# Altium schematic sheet Sheet3.SchDoc
size A; SheetNumber: 1; SheetTotal: 1; SPICEModelCacheSPCDLQCX: <root> / <DocumentId>SPCDLQCX</DocumentId> / <CacheFrame Number="0"> / <Model Name="nmos" Kind="MDL"> / <Text>*Default N-Channel MOSFET / *Pinout: D,G,S / .MODEL NMOS NMOS()</Text> / </Model> / <Model Name="led3" Kind="MDL"> / <Text>*Typ BLUE SiC LED: Vf=3.4V Vr=5V If=40mA trr=3uS / *LED Pinout: 1=A, 2=K / .MODEL LED3 D (IS=93.1P RS=42M N=7.47 BV=5 IBV=30U / + CJO=2.97P VJ=.75 M=.333 TT=4.32U)</Text> / </Model> / <Model Name="led2" Kind="MDL"> / <Text>*Typ RED,GREEN,YELLOW,AMBER GaAs LED: Vf=2.1V Vr=4V If=40mA trr=3uS / *LED Pinout: 1=A, 2=K / .MODEL LED2 D (IS=93.1P RS=42M N=4.61 BV=4 IBV=10U / + CJO=2.97P VJ=.75 M=.333 TT=4.32U)</Text> / </Model> / <Model Name="led1" Kind="MDL"> / <Text>*Typ RED GaAs LED: Vf=1.7V Vr=4V If=40mA trr=3uS / *LED Pinout: 1=A, 2=K / .MODEL LED1 D (IS=93.2P RS=42M N=3.73 BV=4 IBV=10U / + CJO=2.97P VJ=.75 M=.333 TT=4.32U)</Text> / </Model> / </CacheFrame> / </root>
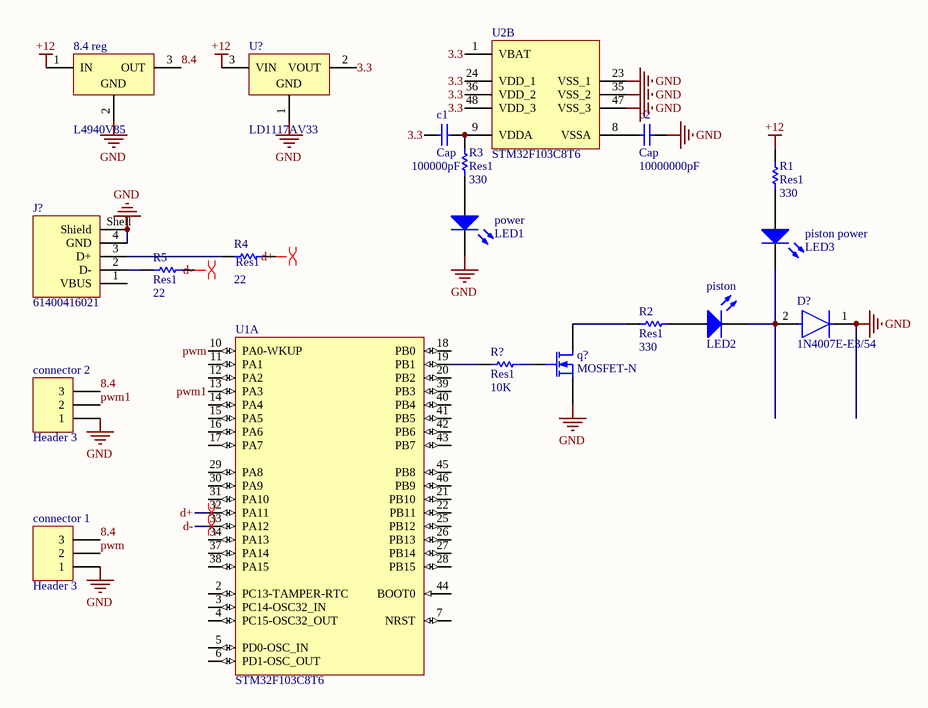
[diagram p0: Sheet3.SchDoc]

## Parts
8.4_reg  L4940V85  [TO220]
c1  Cap  value 100000pF  [RAD-0.3]
c2  Cap  value 10000000pF  [RAD-0.3]
connector_1  Header 3  [HDR1X3]
connector_2  Header 3  [HDR1X3]
D?  1N4007E-E3/54  [FP-1N4007E-E3-54-MFG]
J?  61400416021  [61400416021]
piston  LED2  [3.2X1.6X1.1]
piston_power  LED3  [3.5X2.8X1.9]
power  LED1  [LED-1]
q?  MOSFET-N  [E3]
R1  Res1  value 330  [AXIAL-0.3]
R2  Res1  value 330  [AXIAL-0.3]
R3  Res1  value 330  [AXIAL-0.3]
R4  Res1  value 22  [AXIAL-0.3]
R5  Res1  value 22  [AXIAL-0.3]
R?  Res1  value 10K  [AXIAL-0.3]
U1  STM32F103C8T6  [STM-LQFP48_L]  (part A of 2)
U2  STM32F103C8T6  [STM-LQFP48_L]  (part B of 2)
U?  LD1117AV33  [TO220]

## Nets
+12: 8.4_reg.1(IN) R1.2 U?.3(VIN)
GND: 8.4_reg.2(GND) c2.2 connector_1.1 connector_2.1 D?.1(C) J?.4(GND) J?.Shell(Shield) power.2(K) q?.3(S) U2.23(VSS_1) U2.35(VSS_2) U2.47(VSS_3) U?.1(GND)
3.3: c1.1 U2.1(VBAT) U2.24(VDD_1) U2.36(VDD_2) U2.48(VDD_3) U?.2(VOUT)
8.4: 8.4_reg.3(OUT) connector_1.3 connector_2.3
d+: R4.2 U1.32(PA11)
d-: R5.2 U1.33(PA12)
pwm: connector_1.2 U1.10(PA0-WKUP)
pwm1: connector_2.2 U1.13(PA3)
Netc1_2: c1.2 R3.2 U2.9(VDDA)
Netc2_1: c2.1 U2.8(VSSA)
NetD?_2: D?.2(A) piston.2(K) piston_power.2(K)
NetJ?_2: J?.2(D-) R5.1
NetJ?_3: J?.3(D+) R4.1
Netpiston_1: piston.1(A) R2.2
Netpiston_power_1: piston_power.1(A) R1.1
Netpower_1: power.1(A) R3.1
Netq?_1: q?.1(D) R2.1
Netq?_2: q?.2(G) R?.2
NetR?_1: R?.1 U1.19(PB1)

Not connected (* = marked no-connect by the designer): J? 1(VBUS); U1 2(PC13-TAMPER-RTC) 3(PC14-OSC32_IN) 4(PC15-OSC32_OUT) 5(PD0-OSC_IN) 6(PD1-OSC_OUT) 7(NRST) 11(PA1) 12(PA2) 14(PA4) 15(PA5) 16(PA6) 17(PA7) 18(PB0) 20(PB2) 21(PB10) 22(PB11) 25(PB12) 26(PB13) 27(PB14) 28(PB15) 29(PA8) 30(PA9) 31(PA10) 34(PA13) 37(PA14) 38(PA15) 39(PB3) 40(PB4) 41(PB5) 42(PB6) 43(PB7) 44(BOOT0) 45(PB8) 46(PB9)

## Layout directives
differential pair: d+, d-

## Library data of the parts
8.4_reg = CMP-0244-00412-1: 1.5A Very Low Drop Regulator, 3-Pin TO-220; ComponentLink3URL: http://www.st.com/internet/com/TECHNICAL_RESOURCES/TECHNICAL_LITERATURE/PACKAGE_INFORMATION/CD00004649.pdf; ComponentLink1Description: Manufacturer URL; PackageReference: TO220; ComponentLink2URL: http://www.st.com/internet/com/TECHNICAL_RESOURCES/TECHNICAL_LITERATURE/DATASHEET/CD00000442.pdf; DatasheetVersion: 16/12/2009; PackageDescription: TO, Thru-Hole, Vertical, Heatsink Mounted; 3 In-Line Leads; Pitch 2.54 mm; ComponentLink2Description: Datasheet; PackageVersion: ver3.0; ComponentLink1URL: http://www.st.com; ComponentLink3Description: Package Specification
c1 c2 = Cap: Capacitor; Published: 8-Jun-2000; LatestRevisionDate: 17-Jul-2002; LatestRevisionNote: Re-released for DXP Platform.; PackageReference: RAD-0.3; Publisher: Altium Limited; PackageDescription: Radial Cap, Thru-Hole; 2 Leads; 0.3 in Pin Spacing
connector_1 connector_2 = Header 3: Header, 3-Pin; LatestRevisionDate: 17-Jul-2002; LatestRevisionNote: Re-released for DXP Platform.; Publisher: Altium Limited
D? = CMP-02540-000087-1: DIODE GEN PURP 1KV 1A DO204AL; Peak Non-Repetitive Surge Current: 45A; Forward Voltage: 1.1V; Element Configuration: Single; Max Reverse Current: 5uA; Max Repetitive Reverse Voltage (Vrrm): 1kV; RoHS Compliant: Yes; Max Surge Current: 45A; Min Operating Temperature: -50°C; Radiation Hardening: No; Average Rectified Current: 1A; Series: -; Packaging: Tape and Reel; Contact Plating: Tin; Package Quantity: 5500; Max Reverse Voltage (DC): 1kV; Reverse Voltage: 1kV; Number of Pins: 2; Max Operating Temperature: 150°C; Case/Package: DO-41; Mount: Through Hole
J? = CMP-1502-03227-2: NexarPartId: 21041530; Contact Resistance: 20mΩ; Gender: Receptacle; Voltage Rating (DC): 30V; Current Rating: 1.5A; Connector Type: USB; Insulation Resistance: 1GΩ; USB Standard: USB 2.0; Number of Contacts: 4; Number of Ports: 1; Width: 14.4mm; REACH SVHC: Unknown; Contact Plating: Gold; Length: 15.8mm; Lead Free: Lead Free; Max Operating Temperature: 105°C; Orientation: Horizontal; Contact Material: Copper; Voltage Rating: 30V; Min Operating Temperature: -40°C; Flammability Rating: UL94 V-0; Color: White; RoHS: Compliant; Number of Pins: 4; Mount: Horizontal, Through Hole; Number of Positions: 4; Operating Supply Voltage: 30V; Insulation Material: PBT; Termination: Solder
piston = LED2: Typical RED, GREEN, YELLOW, AMBER GaAs LED; Published: 8-Jun-2000; LatestRevisionDate: 17-Jul-2002; LatestRevisionNote: Re-released for DXP Platform.; PackageVersion: Feb-2002; PackageReference: 3.2X1.6X1.1; Publisher: Altium Limited; PackageDescription: SM LED; 2 Flat Leads
piston_power = LED3: Typical BLUE SiC LED; Published: 8-Jun-2000; LatestRevisionDate: 17-Dec-2003; LatestRevisionNote: PCB Footprint replaced.; DatasheetVersion: 16-Apr-2002; PackageVersion: 16-Apr-2002; PackageReference: 3.5X2.8X1.9; Publisher: Altium Limited; PackageDescription: SM LED; 2 C-Bend Leads; Body 3.5 x 2.8 x 1.9 mm, inc leads (LxWxH typ)
power = LED1: Typical RED GaAs LED; Published: 8-Jun-2000; LatestRevisionDate: 08-Jul-2005; LatestRevisionNote: Mech Layer 1 removed.; PackageReference: LED-1; Publisher: Altium Limited; PackageDescription: LED; 2 Leads
q? = MOSFET-N: N-Channel MOSFET; Published: 8-Jun-2000; LatestRevisionDate: 17-Jul-2002; LatestRevisionNote: Re-released for DXP Platform.; PackageVersion: 1995/1996; PackageReference: E3; Publisher: Altium Limited; PackageDescription: TO, Flat Index; 3 In-Line, Axial Leads; Body Dia. 4.6mm; Lead Dia. 0.5 mm (max)
R1-R5 R? = Res1: Resistor; Published: 8-Jun-2000; LatestRevisionDate: 17-Jul-2002; LatestRevisionNote: Re-released for DXP Platform.; PackageReference: AXIAL-0.3; Publisher: Altium Limited; PackageDescription: Axial Device, Thru-Hole; 2 Leads; 0.3 in Pin Spacing
U1 U2 = CMP-0237-00215-3: ARM Cortex-M3 32-bit MCU, 64 KB Flash, 20 KB Internal RAM, 37 I/Os, 48-pin LQFP, -40 to 85 degC, Tray; Supply Voltage(Vcc) min (V): 2; Internal RAM Size (kB): 20; FLASH Size (Prog) (kB): 64; A/D Converter: 2x12-bit (10 Channel); I/Os (High Current): 37; Operating Frequency(F) (Processor speed) (MHz): 72; Core: ARM Cortex-M3; ComponentLink3Description: Package Specification; Mounting Technology: Surface Mount; PartNumber: STM32F103C8T6; PackageReference: LQFP48; Packing: Tray; ComponentLink3URL: http://www.st.com/st-web-ui/static/active/en/resource/technical/document/datasheet/DM00058181.pdf; DatasheetVersion: Rev. 16; ComponentLink1URL: http://www.st.com/web/en/home.html; PackageVersion: Rev. 6, 06/2013; ComponentLink2URL: http://www.st.com/st-web-ui/static/active/en/resource/technical/document/datasheet/CD00161566.pdf; ComponentLink1Description: Manufacturer URL; ComponentLink2Description: Datasheet; PackageDescription: 48-Pin Low Profile Quad Flat Package, 7 x 7 mm Body, 0.5 mm Pitch
U? = CMP-0244-00460-1: 1A, Low Drop Positive Voltage Regulator, 3.3V, 3-Pin TO-220; ComponentLink1URL: http://www.st.com; PackageDescription: TO, Thru-Hole, Vertical, Heatsink Mounted; 3 In-Line Leads; Pitch 2.54 mm; PackageVersion: ver3.0; ComponentLink3URL: http://www.st.com/internet/com/TECHNICAL_RESOURCES/TECHNICAL_LITERATURE/PACKAGE_INFORMATION/CD00004649.pdf; ComponentLink3Description: Package Specification; ComponentLink1Description: Manufacturer URL; ComponentLink2URL: http://www.st.com/internet/com/TECHNICAL_RESOURCES/TECHNICAL_LITERATURE/DATASHEET/CD00002116.pdf; PackageReference: TO220; DatasheetVersion: 2/12/2011; ComponentLink2Description: Datasheet